# EAGLE design ASBS_radio_v1_2 (EAGLE 5.11)
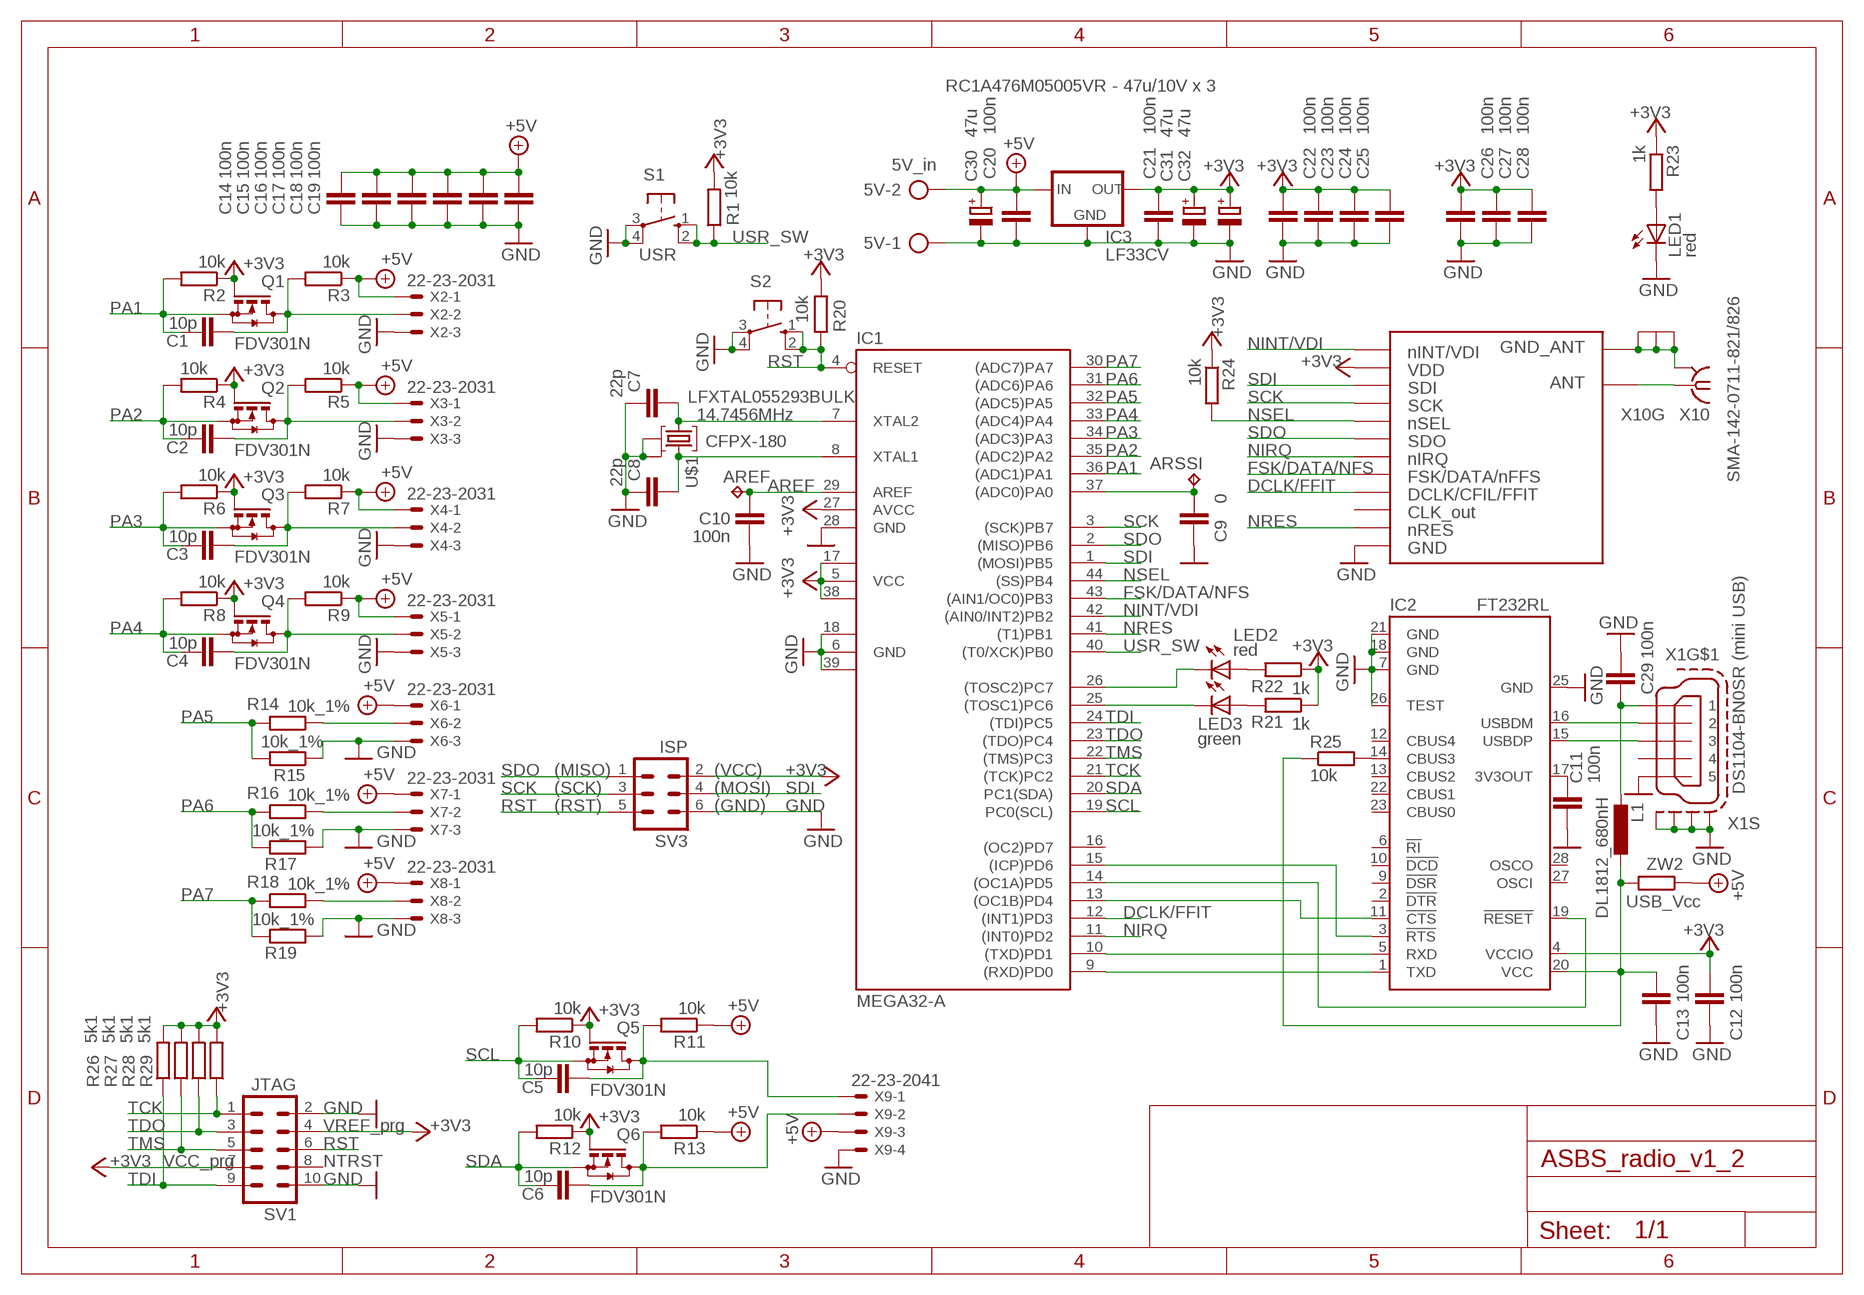
[diagram p0: schematic, sheet 1]

## Parts
5V  5V_in  AK500/2  [AK500/2]
AREF  TPPAD1-13  [P1-13]
ARSSI  TPPAD1-13  [P1-13]
C1  10p  C-EUC0603K  [C0603K]
C2  10p  C-EUC0603K  [C0603K]
C3  10p  C-EUC0603K  [C0603K]
C4  10p  C-EUC0603K  [C0603K]
C5  10p  C-EUC0603K  [C0603K]
C6  10p  C-EUC0603K  [C0603K]
C7  22p  C-EUC0603K  [C0603K]
C8  22p  C-EUC0603K  [C0603K]
C9  0  C-EUC0805  [C0805]
C10  100n  C-EUC0805  [C0805]
C11  100n  C-EUC0805  [C0805]
C12  100n  C-EUC0805  [C0805]
C13  100n  C-EUC0805  [C0805]
C14  100n  C-EUC0805  [C0805]
C15  100n  C-EUC0805  [C0805]
C16  100n  C-EUC0805  [C0805]
C17  100n  C-EUC0805  [C0805]
C18  100n  C-EUC0805  [C0805]
C19  100n  C-EUC0805  [C0805]
C20  100n  C-EUC0805  [C0805]
C21  100n  C-EUC0805  [C0805]
C22  100n  C-EUC0805  [C0805]
C23  100n  C-EUC0805  [C0805]
C24  100n  C-EUC0805  [C0805]
C25  100n  C-EUC0805  [C0805]
C26  100n  C-EUC0805  [C0805]
C27  100n  C-EUC0805  [C0805]
C28  100n  C-EUC0805  [C0805]
C29  100n  C-EUC0805  [C0805]
C30  47u  CPOL-EU153CLV-0505  [153CLV-0505]
C31  47u  CPOL-EU153CLV-0505  [153CLV-0505]
C32  47u  CPOL-EU153CLV-0505  [153CLV-0505]
IC1  MEGA32-A  [TQFP44]
IC2  FT232RL  [SSOP28]
IC3  LF33CV  78XXS  [78XXS]
L1  DL1812_680nH  L-EUL4516C  [L4516C]
LED1  red  LEDCHIP-LED0805  [CHIP-LED0805]
LED2  red  LEDCHIP-LED0805  [CHIP-LED0805]
LED3  green  LEDCHIP-LED0805  [CHIP-LED0805]
Q1  FDV301N  BSS123  [SOT23]
Q2  FDV301N  BSS123  [SOT23]
Q3  FDV301N  BSS123  [SOT23]
Q4  FDV301N  BSS123  [SOT23]
Q5  FDV301N  BSS123  [SOT23]
Q6  FDV301N  BSS123  [SOT23]
R1  10k  R-EU_R0603  [R0603]
R2  10k  R-EU_R0603  [R0603]
R3  10k  R-EU_R0603  [R0603]
R4  10k  R-EU_R0603  [R0603]
R5  10k  R-EU_R0603  [R0603]
R6  10k  R-EU_R0603  [R0603]
R7  10k  R-EU_R0603  [R0603]
R8  10k  R-EU_R0603  [R0603]
R9  10k  R-EU_R0603  [R0603]
R10  10k  R-EU_R0603  [R0603]
R11  10k  R-EU_R0603  [R0603]
R12  10k  R-EU_R0603  [R0603]
R13  10k  R-EU_R0603  [R0603]
R14  10k_1%  R-EU_R0603  [R0603]
R15  10k_1%  R-EU_R0603  [R0603]
R16  10k_1%  R-EU_R0603  [R0603]
R17  10k_1%  R-EU_R0603  [R0603]
R18  10k_1%  R-EU_R0603  [R0603]
R19  10k_1%  R-EU_R0603  [R0603]
R20  10k  R-EU_R0603  [R0603]
R21  1k  R-EU_R0603  [R0603]
R22  1k  R-EU_R0603  [R0603]
R23  1k  R-EU_R0603  [R0603]
R24  10k  R-EU_R0603  [R0603]
R25  10k  R-EU_R0603  [R0603]
R26  5k1  R-EU_R0603  [R0603]
R27  5k1  R-EU_R0603  [R0603]
R28  5k1  R-EU_R0603  [R0603]
R29  5k1  R-EU_R0603  [R0603]
S1  USR  10-XX  [B3F-10XX]
S2  RST  10-XX  [B3F-10XX]
SV1  JTAG  MA05-2  [MA05-2]
SV3  ISP  MA03-2  [MA03-2]
U$1  CFPX-180  [CFPX-180]
U$2  RFM12BS  [RFM12B_RF_SMD]
X1  DS1104-BN0SR (mini USB)  MINI-USB-SCHIELD-32005-201  [32005-201]
X2  22-23-2031  [22-23-2031]
X3  22-23-2031  [22-23-2031]
X4  22-23-2031  [22-23-2031]
X5  22-23-2031  [22-23-2031]
X6  22-23-2031  [22-23-2031]
X7  22-23-2031  [22-23-2031]
X8  22-23-2031  [22-23-2031]
X9  22-23-2041  [22-23-2041]
X10  SMA-142-0711-821/826  [J502-ND-142-0711-821/826]
ZW2  USB_Vcc  R-EU_R0603  [R0603]

## Nets
+3V3: C12.2 C21.1 C22.1 C23.1 C24.1 C25.1 C26.1 C27.1 C28.1 C31.+ C32.+ IC1.5(VCC) IC1.17(VCC1) IC1.27(AVCC) IC1.38(VCC2) IC2.4(VCCIO) IC3.OUT Q1.1(G) Q2.1(G) Q3.1(G) Q4.1(G) Q5.1(G) Q6.1(G) R1.2 R2.1 R4.1 R6.1 R8.1 R10.1 R12.1 R20.2 R21.1 R22.1 R23.1 R24.1 R26.2 R27.2 R28.2 R29.2 SV1.4 SV1.7 SV3.2 U$2.P$2
+5V: 5V.2 C14.1 C15.1 C16.1 C17.1 C18.1 C19.1 C20.1 C30.+ IC3.IN R3.1 R5.1 R7.1 R9.1 R11.1 R13.1 X2.1 X3.1 X4.1 X5.1 X6.1 X7.1 X8.1 X9.3 ZW2.1
AREF: AREF.TP C10.2 IC1.29(AREF)
ARSSI: ARSSI.TP C9.2 IC1.37((ADC0)PA0)
DCLK/FFIT: IC1.12((INT1)PD3) U$2.P$9
FSK/DATA/NFS: IC1.43((AIN1/OC0)PB3) U$2.P$8
GND: 5V.1 C7.1 C8.1 C9.1 C10.1 C11.2 C12.1 C13.1 C14.2 C15.2 C16.2 C17.2 C18.2 C19.2 C20.2 C21.2 C22.2 C23.2 C24.2 C25.2 C26.2 C27.2 C28.2 C29.1 C30.- C31.- C32.- IC1.6(GND) IC1.18(GND1) IC1.28(GND) IC1.39(GND2) IC2.7(GND) IC2.18(GND) IC2.21(GND) IC2.25(GND) IC2.26(TEST) IC3.GND LED1.C R15.1 R17.1 R19.1 S1.3(P) S1.4(P1) S2.3(P) S2.4(P1) SV1.2 SV1.10 SV3.6 U$1.P$2 U$1.P$4 U$2.P$12 X1.5 X1.M1(S:S1) X1.M2(S:S2) X1.M3(S:S3) X1.M4(S:S4) X2.3 X3.3 X4.3 X5.3 X6.3 X7.3 X8.3 X9.4
N$1: IC1.13((OC1B)PD4) IC2.11(!CTS)
N$2: IC1.14((OC1A)PD5) IC2.19(!RESET)
N$3: IC1.15((ICP)PD6) IC2.3(!RTS)
N$4: C2.2 Q2.3(D) R5.2 X3.2
N$5: C8.2 IC1.8(XTAL1) U$1.P$3
N$6: C7.2 IC1.7(XTAL2) U$1.P$1
N$7: IC2.14(CBUS3) R25.2
N$8: C3.2 Q3.3(D) R7.2 X4.2
N$9: C1.2 Q1.3(D) R3.2 X2.2
N$10: C4.2 Q4.3(D) R9.2 X5.2
N$11: U$2.P$13 X10.1
N$12: R14.1 X6.2
N$13: R16.1 X7.2
N$14: IC1.26((TOSC2)PC7) LED2.C
N$15: IC1.9((RXD)PD0) IC2.1(TXD)
N$16: IC1.10((TXD)PD1) IC2.5(RXD)
N$17: IC1.25((TOSC1)PC6) LED3.C
N$18: LED3.A R21.2
N$19: LED2.A R22.2
N$20: R18.1 X8.2
N$21: LED1.A R23.2
N$22: C5.2 Q5.3(D) R11.2 X9.1
N$23: C6.2 Q6.3(D) R13.2 X9.2
N$39: C13.2 IC2.20(VCC) L1.1 R25.1 ZW2.2
N$43: C29.2 L1.2 X1.1
N$44: IC2.16(USBDM) X1.2
N$45: IC2.15(USBDP) X1.3
N$46: C11.1 IC2.17(3V3OUT)
NINT/VDI: IC1.42((AIN0/INT2)PB2) U$2.P$1
NIRQ: IC1.11((INT0)PD2) U$2.P$7
NRES: IC1.41((T1)PB1) U$2.P$11
NSEL: IC1.44((SS)PB4) R24.2 U$2.P$5
PA1: C1.1 IC1.36((ADC1)PA1) Q1.2(S) R2.2
PA2: C2.1 IC1.35((ADC2)PA2) Q2.2(S) R4.2
PA3: C3.1 IC1.34((ADC3)PA3) Q3.2(S) R6.2
PA4: C4.1 IC1.33((ADC4)PA4) Q4.2(S) R8.2
PA5: IC1.32((ADC5)PA5) R14.2 R15.2
PA6: IC1.31((ADC6)PA6) R16.2 R17.2
PA7: IC1.30((ADC7)PA7) R18.2 R19.2
RGND: U$2.P$14 X10.G@1(GND) X10.G@2(GND) X10.G@3(GND) X10.G@4(GND)
RST: IC1.4(RESET) R20.1 S2.1(S) S2.2(S1) SV1.6 SV3.5
SCK: IC1.3((SCK)PB7) SV3.3 U$2.P$4
SCL: C5.1 IC1.19(PC0(SCL)) Q5.2(S) R10.2
SDA: C6.1 IC1.20(PC1(SDA)) Q6.2(S) R12.2
SDI: IC1.1((MOSI)PB5) SV3.4 U$2.P$3
SDO: IC1.2((MISO)PB6) SV3.1 U$2.P$6
TCK: IC1.21((TCK)PC2) R29.1 SV1.1
TDI: IC1.24((TDI)PC5) R26.1 SV1.9
TDO: IC1.23((TDO)PC4) R28.1 SV1.3
TMS: IC1.22((TMS)PC3) R27.1 SV1.5
USR_SW: IC1.40((T0/XCK)PB0) R1.1 S1.1(S) S1.2(S1)
Unconnected: IC1.16((OC2)PD7) IC2.2(!DTR) IC2.6(!RI) IC2.9(!DSR) IC2.10(!DCD) IC2.12(CBUS4) IC2.13(CBUS2) IC2.22(CBUS1) IC2.23(CBUS0) IC2.27(OSCI) IC2.28(OSCO) SV1.8 U$2.P$10 X1.4

## Notes on the sheet
- RC1A476M05005VR - 47u/10V x 3
- LFXTAL055293BULK
- 14.7456MHz
- (MISO) | (VCC)
- (SCK) | (MOSI)
- (RST) | (GND)
- GND
- VREF_prg
- VCC_prg | NTRST
- GND

## Library data of the parts
5V = con-ptr500:AK500/2: CONNECTOR; OC_FARNELL: unknown; OC_NEWARK: unknown
AREF ARSSI = testpad:TP: Test pad
C1-C6 C9-C29 = rcl:C-EU: CAPACITOR, European symbol
C7 C8 = resistor:C-EU: CAPACITOR, European symbol
C30-C32 = rcl:CPOL-EU: POLARIZED CAPACITOR, European symbol
IC1 = atmel:MEGA32: MICROCONTROLLER 32 Kbytes FLASH 2 Kbytes SRAM 1 Kbytes EEPROM USART 8-channel 10 bit ADC Source: www.atmel.com .. doc2503.pdf; MPN: ATMEGA32-16AU; OC_FARNELL: 9171274; OC_NEWARK: 69K6677
IC2 = ftdichip:FT232R: Source: http://www.ftdichip.com/Documents/DataSheets/DS_FT232R_v104.pdf; MPN: FT232RL; OC_FARNELL: 1146032; OC_NEWARK: 91K9918
IC3 = v-reg:78XXS: VOLTAGE REGULATOR
L1 = rcl:L-EU: INDUCTOR, European symbol
LED1-LED3 = led:LED: LED OSRAM: - CHIPLED LG R971, LG N971, LY N971, LG Q971, LY Q971, LO R971, LY R971 LH N974, LH R974 LS Q976, LO Q976, LY Q976 LO Q996 - Hyper CHIPLED LW Q18S LB Q993, LB Q99A, LB R99A - SideLED LS A670, LO A670, LY A670, LG A670, LP A670 LB A673, LV A673, LT A673, LW A673 LH A674 LY A675 LS A676, LA A676, LO A676, LY A676, LW A676 LS A679, LY A679, LG A679 - Hyper Micro SIDELED® LS Y876, LA Y876, LO Y876, LY Y876 LT Y87S - SmartLED LW L88C, LW L88S LB L89C, LB L89S, LG L890 LS L89K, LO L89K, LY L89K LS L896, LA L896, LO L896, LY L896 - TOPLED LS T670, LO T670, LY T670, LG T670, LP T670 LSG T670, LSP T670, LSY T670, LOP T670, LYG T670 LG T671, LOG T671, LSG T671 LB T673, LV T673, LT T673, LW T673 LH T674 LS T676, LA T676, LO T676, LY T676, LB T676, LH T676, LSB T676, LW T676 LB T67C, LV T67C, LT T67C, LS T67K, LO T67K, LY T67K, LW E67C LS E67B, LA E67B, LO E67B, LY E67B, LB E67C, LV E67C, LT E67C LW T67C LS T679, LY T679, LG T679 LS T770, LO T770, LY T770, LG T770, LP T770 LB T773, LV T773, LT T773, LW T773 LH T774 LS E675, LA E675, LY E675, LS T675 LS T776, LA T776, LO T776, LY T776, LB T776 LHGB T686 LT T68C, LB T68C - Hyper Mini TOPLED® LB M676 - Mini TOPLED Santana® LG M470 LS M47K, LO M47K, LY M47K Source: http://www.osram.convergy.de LUXEON: - LUMILED® LXK2-PW12-R00, LXK2-PW12-S00, LXK2-PW14-U00, LXK2-PW14-V00 LXK2-PM12-R00, LXK2-PM12-S00, LXK2-PM14-U00 LXK2-PE12-Q00, LXK2-PE12-R00, LXK2-PE12-S00, LXK2-PE14-T00, LXK2-PE14-U00 LXK2-PB12-K00, LXK2-PB12-L00, LXK2-PB12-M00, LXK2-PB14-N00, LXK2-PB14-P00, LXK2-PB14-Q00 LXK2-PR12-L00, LXK2-PR12-M00, LXK2-PR14-Q00, LXK2-PR14-R00 LXK2-PD12-Q00, LXK2-PD12-R00, LXK2-PD12-S00 LXK2-PH12-R00, LXK2-PH12-S00 LXK2-PL12-P00, LXK2-PL12-Q00, LXK2-PL12-R00 Source: www.luxeon.com KINGBRIGHT: KA-3528ASYC Source: www.kingbright.com
Q1-Q6 = transistor-small-signal:BSS123: N-CHANNEL MOS FET
R1-R29 ZW2 = resistor:R-EU_: RESISTOR, European symbol
S1 S2 = switch-omron:10-XX: OMRON SWITCH; MPN: B3F-1000; OC_FARNELL: 176432; OC_NEWARK: 36M3542
SV1 = con-lstb:MA05-2: PIN HEADER; OC_FARNELL: unknown; OC_NEWARK: unknown
SV3 = con-lstb:MA03-2: PIN HEADER; OC_FARNELL: unknown; OC_NEWARK: unknown
U$1 = crystal_frequency_products:CFPX-180
U$2 = RFM12B:RFM12B
X1 = con-cypressindustries:MINI-USB-SCHIELD-: MINI USB-B Conector Source: www.cypressindustries.com; OC_FARNELL: unknown; OC_NEWARK: unknown
X2-X8 = con-molex:22-23-2031: .100" (2.54mm) Center Header - 3 Pin; MF: MOLEX; MPN: 22-23-2031; OC_FARNELL: 1462950; OC_NEWARK: 30C0862
X9 = con-molex:22-23-2041: .100" (2.54mm) Center Header - 4 Pin; MF: MOLEX; MPN: 22-23-2041; OC_FARNELL: 1462920; OC_NEWARK: 38C0355
X10 = con-coax:SMA-: SMA 50 Ohm End Launch Jack Receptacle - Round Contact Johnson Components Source: www.johnsoncomponents.com .. J502-ND.pdf; MF: JOHNSON COMPONENTS; MPN: 142-0711-821; OC_FARNELL: 1019328; OC_NEWARK: 16F3627

## Board
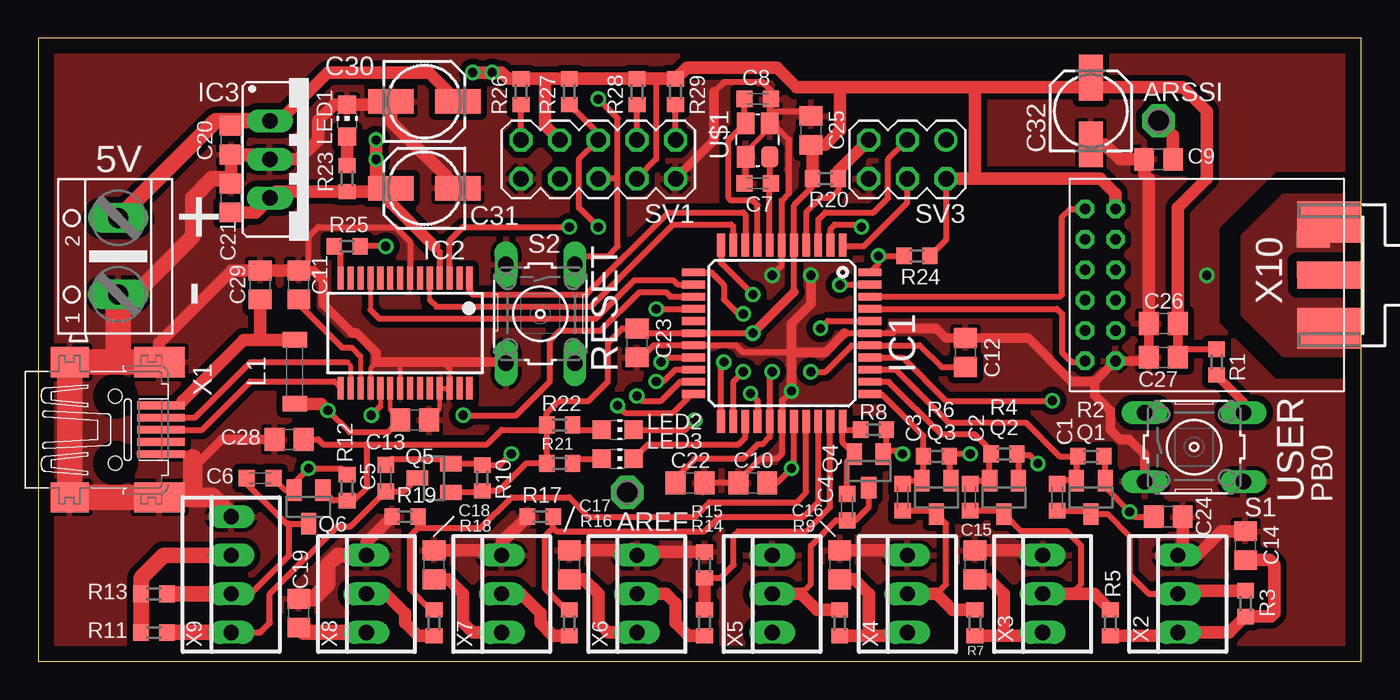
[diagram p1: board, top side]
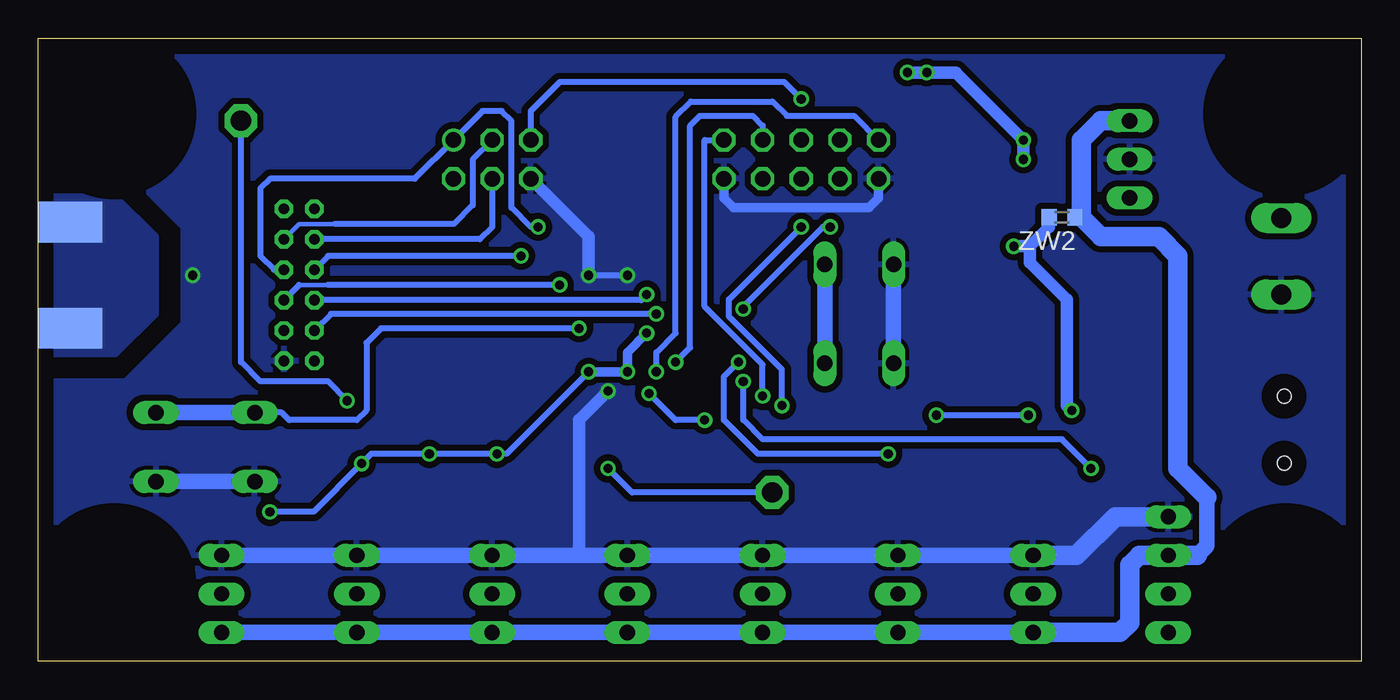
[diagram p2: board, bottom side, seen from below]

Size 87 x 41 mm. Coordinates in mm from the lower left corner, seen from the top.
Outline: 0,0 87,0 87,41 0,41 0,0
Copper layers (1*16): Top 0.035mm / dielectric 1.5mm / Bottom 0.035mm
Design rules "default *": minimum track width 10mil, minimum drill 0.4mm, track to track 9mil, track to pad 9mil, pad to pad 9mil, via to via 9mil, smd to smd 8mil, copper to edge 40mil, drill to drill 8mil, minimum pad ring 10mil, minimum via ring 8mil, stop-mask expansion 4mil, vias tented up to drill 0mil, thermal gap 10mil
bRestrict: area 77.5,0.5 to 86.5,9.5; area 77.5,31.5 to 86.5,40.5; area 0.5,0.5 to 9.5,9.5; area 0.5,31.5 to 9.5,40.5

### Footprints (pad centres in the part's own frame; a part is rotated, then mirrored left to right if it is on the bottom)
AK500/2 = drill 1.321 long: 1 -2.515,0; 2 2.515,0
P1-13 = drill 1.321 pad 2.159 octagon: TP 0,0
C0603K = smd 1.05 x 1.08: 1 -0.875,0; 2 0.875,0
C0805 = smd 1.3 x 1.5: 1 -0.95,0; 2 0.95,0
153CLV-0505 = smd 3 x 1.6: + 2.2,0; - -2.2,0
TQFP44 = smd 1.5 x 0.5: 1 -5.8,4; 2 -5.8,3.2; 3 -5.8,2.4; 4 -5.8,1.6; 5 -5.8,0.8; 6 -5.8,0; 7 -5.8,-0.8; 8 -5.8,-1.6; 9 -5.8,-2.4; 10 -5.8,-3.2; 11 -5.8,-4; 23 5.8,-4; 24 5.8,-3.2; 25 5.8,-2.4; 26 5.8,-1.6; 27 5.8,-0.8; 28 5.8,0; 29 5.8,0.8; 30 5.8,1.6; 31 5.8,2.4; 32 5.8,3.2; 33 5.8,4 | smd 0.5 x 1.5: 12 -4,-5.8; 13 -3.2,-5.8; 14 -2.4,-5.8; 15 -1.6,-5.8; 16 -0.8,-5.8; 17 0,-5.8; 18 0.8,-5.8; 19 1.6,-5.8; 20 2.4,-5.8; 21 3.2,-5.8; 22 4,-5.8; 34 4,5.8; 35 3.2,5.8; 36 2.4,5.8; 37 1.6,5.8; 38 0.8,5.8; 39 0,5.8; 40 -0.8,5.8; 41 -1.6,5.8; 42 -2.4,5.8; 43 -3.2,5.8; 44 -4,5.8
SSOP28 = smd 0.4 x 1.5: 1 -4.225,-3.625; 2 -3.575,-3.625; 3 -2.925,-3.625; 4 -2.275,-3.625; 5 -1.625,-3.625; 6 -0.975,-3.625; 7 -0.325,-3.625; 8 0.325,-3.625; 9 0.975,-3.625; 10 1.625,-3.625; 11 2.275,-3.625; 12 2.925,-3.625; 13 3.575,-3.625; 14 4.225,-3.625; 15 4.225,3.625; 16 3.575,3.625; 17 2.925,3.625; 18 2.275,3.625; 19 1.625,3.625; 20 0.975,3.625; 21 0.325,3.625; 22 -0.325,3.625; 23 -0.975,3.625; 24 -1.625,3.625; 25 -2.275,3.625; 26 -2.925,3.625; 27 -3.575,3.625; 28 -4.225,3.625
78XXS = drill 1.016 long: GND 0,-2.54; IN -2.54,-2.54; OUT 2.54,-2.54
L4516C = smd 1 x 1.6: 1 -2.1,0; 2 2.1,0
CHIP-LED0805 = smd 1.2 x 1.2: A 0,-1.05; C 0,1.05
SOT23 = smd 1 x 1.4: 1 -0.95,-1.1; 2 0.95,-1.1; 3 0,1.1
R0603 = smd 1 x 1.1: 1 -0.85,0; 2 0.85,0
B3F-10XX = drill 1.016 long: 1 -3.251,2.261; 2 3.251,2.261; 3 -3.251,-2.261; 4 3.251,-2.261
MA05-2 = drill 1.016 octagon: 1 -5.08,-1.27; 2 -5.08,1.27; 3 -2.54,-1.27; 4 -2.54,1.27; 5 0,-1.27; 6 0,1.27; 7 2.54,-1.27; 8 2.54,1.27; 9 5.08,-1.27; 10 5.08,1.27
MA03-2 = drill 1.016 round: 1 -2.54,-1.27 | drill 1.016 octagon: 2 -2.54,1.27; 3 0,-1.27; 4 0,1.27; 5 2.54,-1.27; 6 2.54,1.27
CFPX-180 = smd 1.4 x 1.15: P$1 -1.1,-0.8; P$2 1.1,-0.8; P$3 1.1,0.8; P$4 -1.1,0.8
RFM12B_RF_SMD = drill 0.7 octagon: P$1 -8,5; P$2 -6,5; P$3 -8,3; P$4 -6,3; P$5 -8,1; P$6 -6,1; P$7 -8,-1; P$8 -6,-1; P$9 -8,-3; P$10 -6,-3; P$11 -8,-5; P$12 -6,-5 | smd 2.184 x 1.067: P$13 7,1; P$14 7,3
32005-201 = smd 3.1 x 0.5: 1 3,1.6; 2 3,0.8; 3 3,0; 4 3,-0.8; 5 3,-1.6 | smd 2.5 x 2: M1 -3,-4.45; M2 -3,4.45 | smd 3.3 x 2: M3 2.9,4.45; M4 2.9,-4.45 | hole 0.9: 0,2.2; 0,-2.2
22-23-2031 = drill 1 long: 1 -2.54,0; 2 0,0; 3 2.54,0
22-23-2041 = drill 1 long: 1 -3.81,0; 2 -1.27,0; 3 1.27,0; 4 3.81,0
J502-ND-142-0711-821/826 = smd 4.191 x 1.778: 1 2.115,0 | smd 4.191 x 2.667: G@1 2.115,3.495; G@2 2.115,-3.495 | smd 4.191 x 2.667 bottom: G@3 2.115,3.495; G@4 2.115,-3.495

### Placement (x,y rotation side)
5V  5.27,26.65 90 top
AREF  38.73,11.11 0 top
ARSSI  73.66,35.56 0 top
C1  66.99,10.79 270 top
C2  61.28,10.79 270 top
C3  56.83,10.79 270 top
C4  53.18,10.16 270 top
C5  22.86,12.06 270 top
C6  14.61,12.06 180 top
C7  47.31,31.43 0 top
C8  47.31,36.99 180 top
C9  73.66,33.02 0 top
C10  46.99,11.75 0 top
C11  17.14,24.77 90 top
C12  60.96,20.32 270 top
C13  24.77,15.88 180 top
C14  79.38,7.62 90 top
C15  61.59,6.35 90 top
C16  52.7,6.35 90 top
C17  34.92,6.35 90 top
C18  26.04,6.35 90 top
C19  17.14,3.17 90 top
C20  12.7,34.29 270 top
C21  12.7,30.48 90 top
C22  42.86,11.75 0 top
C23  39.37,20.95 270 top
C24  74.3,9.53 0 top
C25  50.8,34.92 90 top
C26  73.98,22.23 180 top
C27  73.98,20 180 top
C28  16.51,14.61 180 top
C29  14.61,24.77 270 top
C30  25.4,36.83 0 top
C31  25.4,31.11 180 top
C32  69.22,36.2 90 top
IC1  48.9,21.59 270 top
IC2  24.13,21.59 180 top
IC3  17.78,33.02 270 top
L1  16.88,19.05 90 top
LED1  20.32,35.56 0 top
LED2  38.1,15.24 270 top
LED3  38.1,13.34 270 top
Q1  69.22,10.79 180 top
Q2  63.5,10.79 180 top
Q3  59.05,10.79 180 top
Q4  54.61,12.54 180 top
Q5  26.04,12.06 90 top
Q6  17.78,10.16 180 top
R1  77.47,19.68 90 top
R2  69.22,13.49 180 top
R3  79.38,3.81 90 top
R4  63.5,13.65 180 top
R5  70.48,2.54 90 top
R6  59.05,13.49 180 top
R7  61.59,2.54 90 top
R8  54.93,15.24 180 top
R9  52.7,2.54 90 top
R10  29.21,12.06 90 top
R11  7.62,1.91 0 top
R12  20.32,11.43 90 top
R13  7.62,4.45 0 top
R14  43.81,2.54 90 top
R15  43.81,6.35 270 top
R16  34.92,2.54 90 top
R17  33.02,9.53 0 top
R18  26.04,2.54 90 top
R19  24.13,9.53 0 top
R20  51.75,31.75 180 top
R21  34.29,13.02 0 top
R22  34.29,15.56 0 top
R23  20.32,31.75 90 top
R24  57.78,26.67 180 top
R25  20.32,27.3 180 top
R26  31.75,37.47 90 top
R27  34.92,37.47 90 top
R28  39.37,37.47 90 top
R29  41.91,37.47 90 top
S1  76,14.1 0 top
S2  33.02,22.86 270 top
SV1  36.83,33.02 180 top
SV3  57.15,33.02 180 top
U$1  47.31,34.29 90 top
U$2  76.83,24.77 0 top
X1  5.08,15.24 0 top
X2  74.93,4.45 90 top
X3  66.04,4.45 90 top
X4  57.15,4.45 90 top
X5  48.26,4.45 90 top
X6  39.37,4.45 90 top
X7  30.48,4.45 90 top
X8  21.59,4.45 90 top
X9  12.7,5.71 90 top
X10  87,25.4 180 top
ZW2  19.68,29.21 180 bottom

### Tracks (layer width: path | path; a pad name or v marks a point on that pad's centre or on a via)
+3V3  (via drill 0.6, 0.6 pad 0.3, 0.6 pad 0.61)
  Top 0.406: R22.1 R21.1 32.07,13.02 30.27,11.21 R10.1 29.11,11.12 Q5.1 | 50.9,33.87 C25.1 | C22.1 41.91,12.07 43.18,13.34 46.35,13.34 47.31,14.29 47.62,14.29 48.09,14.76 IC1.27 48.09,18.89 v48.26,19.05 | 50.8,31.85 R20.2 50.9,31.22 49.7,30.01 IC1.5 49.7,24.3 | v46.99,21.59 IC1.17 39.69,21.59 C23.1 38.41,21.91 37.47,20.95 37.47,18.41 36.2,17.14 34.29,17.14 33.44,16.3 R22.1 | SV1.4 40.64,33.02 40.64,38.31 | IC2.4 26.41,26.93 26.04,27.3 | R1.2 75.46,20.54 C27.1 | R2.1 70.17,13.39 Q1.1 70.17,11.43 v71.75,9.84 72.07,9.53 C24.1 | 64.45,13.55 Q2.1 | 64.45,13.55 R4.1 | Q3.1 59.91,11.99 R6.1 60.06,13.65 v61.28,13.65 | 55.78,13.86 R8.1 | 55.78,13.86 Q4.1 | 55.78,13.86 56.63,13.86 v56.83,13.65 | 64.45,13.55 65.19,13.55 v65.72,13.02 | v50.8,19.05 51.75,19.05 53.49,20.79 IC1.38 57.95,20.79 59.37,19.37 C12.2 | Q6.1 19.41,10.58 R12.1 20.74,10.58 21.59,11.43 21.59,14.29 | C28.1 18.41,14.61 18.73,14.29 21.59,14.29 | R22.1 33.12,15.24 30.48,15.24 29.53,14.29 21.59,14.29 | R24.1 59.69,27.73 SV3.2
  Top 0.61: v46.99,21.59 49.7,24.3 | C26.1 C27.1
  Top 0.813: R20.2 50.9,33.87 | C21.1 14.29,29.53 IC3.OUT 15.66,30.9 R23.1 22.23,30.9 | 33.34,38.31 R26.2 30.9,38.31 30.48,38.73 v29.84,38.73 v28.57,38.73 | 33.34,38.31 R27.2 R28.2 40.64,38.31 R29.2 42.65,39.05 48.58,39.05 49.85,37.78 52.7,37.78 | SV1.7 33.34,35.24 33.34,38.31 | 26.04,27.3 23.2,30.14 C31.+ 22.98,30.9 22.23,30.9 | C25.1 51.76,33.98 52.7,34.92 52.7,37.78 | U$2.P$2 70.83,30.77 69.85,31.75 61.59,31.75 | v22.23,34.29 v22.23,33.02 22.23,30.9 | C26.1 74.93,29.84 76.83,31.75 76.83,36.2 75.25,37.78 68.58,37.78 | 61.59,37.78 68.58,37.78 | C32.+ 69.19,38.4 68.58,37.78 | 61.59,31.75 SV3.2 | 61.59,37.78 61.59,31.75 | 52.7,37.78 61.59,37.78
  Bottom 0.406: v71.75,9.84 68.9,9.84 v65.72,13.02 65.09,13.65 v61.28,13.65 v56.83,13.65 56.2,13.65 v50.8,19.05
  Bottom 0.61: v46.99,21.59 48.26,20.32 v48.26,19.05 v50.8,19.05
  Bottom 0.813: v29.84,38.73 v28.57,38.73 26.67,38.73 v22.23,34.29 v22.23,33.02
+5V
  Top 0.813: C20.1 13.02,35.56 13.97,35.56 IC3.IN 15.88,35.56 19.05,38.73 25.7,38.73 C30.+ | X3.1 65.83,1.69 63.28,1.69 | 63.28,1.69 63.5,1.91 63.5,4.45 62.55,5.4 C15.1 | 63.28,1.69 R7.1 | R5.1 74.72,1.69 X2.1 78.32,1.91 R3.1 81.06,2.96 81.28,3.17 81.28,6.35 80.96,6.67 C14.1 | 54.61,1.69 56.94,1.69 X4.1 | 54.61,1.69 R9.1 | 54.61,1.69 54.61,4.45 53.66,5.4 C16.1 | X6.1 37.47,1.91 36.83,2.54 36.83,4.45 35.88,5.4 C17.1 | X7.1 28.57,1.91 27.94,2.54 27.94,4.45 26.98,5.4 C18.1
  Top 1.016: C19.1 17.46,1.91 X8.1 | R11.1 R13.1 6.77,5.5 8.26,6.99 X9.3 | 5V.2 11.66,35.56 13.97,35.56
  Bottom 1.016: X8.1 X7.1 X6.1 X5.1 X4.1 X3.1 X2.1 | 10.79,6.99 10.16,7.62 10.16,10.79 | 18.41,29.21 ZW2.1
  Bottom 1.27: X8.1 15.88,1.91 15.24,2.54 15.24,6.35 14.61,6.99 X9.3 | X9.3 10.79,6.99 | X9.3 13.34,6.99 | IC3.IN 17.14,35.56 18.41,34.29 18.41,29.21 17.14,27.94 13.34,27.94 12.06,26.67 12.06,12.7 10.16,10.79
AREF  (via drill 0.6)
  Top 0.406: IC1.29 49.7,12.87 v49.53,12.7 48.58,11.75 C10.2
  Bottom 0.406: AREF.TP 47.94,11.11 v49.53,12.7
ARSSI  (via drill 0.6 pad 0.61)
  Top 0.406: IC1.37 56.84,19.99 59.69,17.14 v66.67,17.14
  Top 0.813: C9.2 74.61,34.61 ARSSI.TP
  Bottom 0.406: v66.67,17.14 67.94,18.41 72.39,18.41 73.66,19.68 ARSSI.TP
DCLK/FFIT  (via drill 0.6)
  Top 0.406: v46.35,22.86 46.04,22.86 45.09,23.81 45.09,24.77 44.26,25.59 IC1.12
  Bottom 0.406: U$2.P$9 67.74,22.86 v46.35,22.86
FSK/DATA/NFS  (via drill 0.6)
  Top 0.406: v52.7,24.77 52.73,24.79 IC1.43
  Bottom 0.305: 67.94,24.77 69.85,24.77
  Bottom 0.406: U$2.P$8 69.85,24.75 69.85,24.77 | v52.7,24.77 67.94,24.77
GND  (via drill 0.6)
  Top 0.305: IC2.18 21.86,19.32 22.23,19.68 | 27.05,19.3 IC2.26 IC2.25 26.41,16.57 C13.1 | 23.8,19.68 IC2.21 | 48.11,35.09 46.51,33.49
  Top 0.406: 26.67,19.68 27.05,19.3 | v48.26,25.4 48.9,26.04 IC1.6 48.9,30.32 49.37,30.8 49.37,34.29 48.27,35.39 U$1.P$2 | U$1.P$2 48.43,35.39 | U$1.P$2 48.11,36.2 | 48.11,36.2 48.11,36.91 C8.1 48.18,37.54 47.62,38.1 45.09,38.1 44.45,37.47 | 46.51,33.49 U$1.P$4 46.51,31.51 C7.1 | U$1.P$2 48.11,35.09 | C25.2 50.48,36.2 48.11,36.2 | C22.2 C10.1 46.04,11.91 47.47,13.34 48.58,13.34 48.9,13.65 IC1.28 48.9,17.14 v49.53,17.78 | 49.53,20.32 46.35,20.32 45.88,20.79 IC1.18 40.47,20.79 39.69,20 C23.2 | 56.52,21.91 56.2,21.59 IC1.39 53.02,21.59 | 72.79,19.77 arc90 C27.2 | IC2.7 24.45,27.61 23.5,28.57 18.41,28.57 17.78,27.94 17.78,26.35 C11.2 | X1.5 9.86,13.64 10.16,13.34
  Top 0.61: C11.2 18.1,25.71 18.73,25.08 18.73,23.5 20.64,21.59 20.95,21.59 22.23,20.32 22.23,19.68 23.8,19.68 26.67,19.68 30.68,19.68 S2.4 | SV1.2 44.45,34.29 44.45,37.47 | C27.2 C26.2 | v49.53,17.78 49.53,20.32 | 53.02,21.59 51.75,20.32 49.53,20.32 | v50.8,25.4 50.8,23.5 49.53,22.23 49.53,20.32 | S1.3 72.74,13.62 71.75,14.61 71.12,14.61 70.48,15.24 70.48,16.51 69.48,17.51 69.48,18.41 | 56.52,21.91 59.05,21.91 59.69,21.27 C12.1 65.09,21.27 67.94,18.41 69.48,18.41 | 72.79,19.77 U$2.P$12 69.48,18.41 | C28.2 12.06,14.61 10.16,12.7
  Top 0.813: C11.2 C29.1 12.73,25.71 7.98,20.96 X1.M3 | C21.2 C20.2 14.92,33.34 IC3.GND 17.14,33.02 18.41,34.29 18.41,35.56 19.46,36.61 LED1.C 22.98,36.61 C30.- 23.2,35.52 C31.- | X3.3 65.72,7.3 C15.2 | C14.2 77.78,8.57 76.2,6.99 X2.3 75.25,7.3 C24.2 | R15.1 39.59,7.2 X6.3 | R17.1 30.48,7.83 X7.3 | R19.1 21.59,7.83 X8.3 | C32.- 70.14,33.99 71.12,33.02 C9.1 72.71,32.06 73.03,31.75 C26.2 | 30.16,7.3 C18.2 | 39.05,7.3 C17.2 | C16.2 56.84,7.3 X4.3
  Top 1.016: X6.3 39.05,7.3 | X7.3 30.16,7.3 | C19.2 18.09,4.12 19.05,5.08 19.05,6.35 19.68,6.99 X8.3 | 5V.1 6.36,24.14 10.16,27.94 10.16,30.48 11.43,31.75 12.38,31.75 C21.2 | X1.M4 10.16,10.79
  Top 1.27: 10.16,13.34 10.16,12.7 10.16,10.79 | X9.4 11.44,10.79 X1.M4
  Top 1.676: X1.M4 X1.M1 X1.M2 5.08,19.69 | 5.08,19.69 X1.M3 | 5V.1 5.27,19.88 5.08,19.69
  Bottom 0.406: v50.8,25.4 v48.26,25.4
  Bottom 0.61: SV1.10 31.75,30.48 32.38,29.84 41.27,29.84 41.91,30.48 SV1.2
  Bottom 0.813: v49.53,17.78 51.44,15.88 51.44,6.99 | SV3.6 50.8,27.94 v50.8,25.4
  Bottom 1.016: X8.3 X7.3 X6.3 X5.3 51.44,6.99 X4.3 X3.3 X2.3 | S2.4 S2.3 | S1.3 S1.4
  Bottom 1.27: X8.3 18.73,6.99 16.2,9.53 X9.4
  other vias: 76.83,25.4
  pour Bottom (isolate 0.406): 0,41 87,41 87,33 87,33 87,32.38 81.28,32.38 77.47,28.57 77.47,22.23 81.28,18.41 86.04,18.41 87,18.41 87,14 87,0 0,0
  pour Top (isolate 0.406): 0,41 87,41 87,34 87,32.38 83.82,32.38 81.28,32.38 77.47,28.57 77.47,22.23 81.28,18.41 86.36,18.41 87,18.41 87,0 0,0
N$1
  Top 0.305: 21.86,23.12 IC2.11
  Top 0.406: IC1.13 42.04,24.79 41.75,25.08 39.21,25.08 36.67,22.54 22.44,22.54 21.86,23.12
N$2  (via drill 0.6)
  Top 0.305: 22.5,16.79 IC2.19
  Top 0.406: v21.91,16.19 22.5,16.79 | v27.94,16.19 31.43,16.19 33.66,18.41 33.66,21.11 34.29,21.75 36.99,21.75 39.53,24.29 41.27,24.29 41.57,23.99 IC1.14
  Bottom 0.406: v21.91,16.19 v27.94,16.19
N$3  (via drill 0.6, 0.6 pad 0.61)
  Top 0.406: IC2.3 27.05,27.69 27.94,28.57 v34.92,28.57 | IC1.15 40.63,23.19 v40.64,23.18
  Bottom 0.406: v34.92,28.57 35.4,28.57 40.64,23.34 v40.64,23.18
N$4
  Top 0.406: X3.2 67.94,4.45 68.58,5.08 68.58,7.62 67.63,8.57 64.62,8.57 Q2.3 63.27,9.92 C2.2
  Top 0.813: R5.2 69.43,4.45 X3.2
N$5
  Top 0.406: IC1.8 47.31,27.4 47.31,30 46.99,30.32 45.56,30.32 45.4,30.48 45.4,34.28 U$1.P$3 46.43,35.47 C8.2
N$6
  Top 0.406: U$1.P$1 48.11,31.51 C7.2 48.09,31.34 IC1.7
N$7
  Top 0.406: IC2.14 19.91,26.87 R25.2
N$8
  Top 0.406: C3.2 58.83,9.92 Q3.3 59.69,9.06 59.69,5.08 59.05,4.45
  Top 0.813: R7.2 60.11,3.39 59.05,4.45 X4.2
N$9
  Top 0.406: C1.2 68.99,9.92 Q1.3 70.31,9.7 71.75,8.26 71.75,5.71 73.03,4.45 X2.2
  Top 0.813: X2.2 75.14,4.66 R3.2
N$10
  Top 0.406: Q4.3 54.61,10.16 53.73,9.29 C4.2 52.47,9.29 50.8,7.62 50.8,5.08 50.16,4.45
  Top 0.813: R9.2 51.22,3.39 50.16,4.45 X5.2
N$11
  Top 0.61: X10.1 84.52,25.77 U$2.P$13
N$12
  Top 0.813: R14.1 42.76,1.69 41.91,2.54 41.91,3.81 41.27,4.45 X6.2
N$13
  Top 0.813: R16.1 33.87,1.69 33.02,2.54 33.02,3.17 31.75,4.45 X7.2
N$14  (via drill 0.6)
  Top 0.406: v46.83,17.62 47.3,17.16 IC1.26 | LED2.C 42.55,15.24 v43.18,15.88
  Bottom 0.406: v43.18,15.88 45.09,15.88 v46.83,17.62
N$15
  Top 0.305: IC2.1 28.36,24.35
  Top 0.406: IC1.9 46.49,29.39 46.35,29.53 41.43,29.53 36.04,24.13 28.57,24.13 28.36,24.35
N$16
  Top 0.305: IC2.5 25.75,23.77
  Top 0.406: IC1.10 45.7,28.6 45.56,28.73 41.75,28.73 36.35,23.34 26.19,23.34 25.75,23.77
N$17
  Top 0.406: IC1.25 46.49,14.74 46.04,14.29 40.1,14.29 LED3.C
N$18
  Top 0.406: LED3.A 35.46,13.34 R21.2
N$19
  Top 0.406: LED2.A 35.46,15.24 R22.2
N$20
  Top 0.813: R18.1 24.98,1.69 24.13,2.54 24.13,3.17 22.86,4.45 X8.2
N$21
  Top 0.813: R23.2 LED1.A
N$22
  Top 0.406: X9.1 14.61,1.91 15.24,2.54 15.24,4.45 19.68,8.89 20.56,8.89 C5.2 24.06,11.19 Q5.3
  Top 1.016: R11.2 X9.1
N$23
  Top 0.406: C6.2 13.73,11.67 16.34,9.06 16.51,9.06 | 16.51,9.06 Q6.3 | X9.2 13.97,4.45 16.51,6.99 16.51,9.06
  Top 1.016: R13.2 X9.2
N$39  (via drill 0.6)
  Top 0.305: IC2.20 23.16,16.54 C13.2
  Top 0.406: v19.05,16.51 20.48,15.08 23.02,15.08 C13.2 | v22.86,27.3 R25.1
  Top 0.61: L1.1 16.88,16.88
  Top 0.813: L1.1 18.61,16.95 v19.05,16.51
  Bottom 0.813: v19.05,16.51 19.37,16.83 19.37,23.81 21.8,26.25 21.8,27.3 | 21.8,27.3 v22.86,27.3 | 21.8,27.3 20.54,28.57 ZW2.2
N$43
  Top 0.406: 9.53,17.14 9.22,16.84 X1.1
  Top 0.813: 14.61,21.15 13.53,21.15 9.53,17.14 | 14.61,21.15 C29.2 | 14.61,21.15 L1.2
N$44
  Top 0.305: 20.32,19.68 20.55,19.45 IC2.16
  Top 0.406: X1.2 10.32,16.04 13.97,19.68 20.32,19.68
N$45
  Top 0.305: 19.45,18.41 IC2.15
  Top 0.406: X1.3 10.79,15.24 13.97,18.41 19.45,18.41
N$46
  Top 0.305: 21.2,20.07 IC2.17
  Top 0.406: 21.2,20.07 20.64,20.64 20,20.64 17.14,23.5 C11.1
NINT/VDI
  Top 0.406: U$2.P$1 67.86,29.77 67.31,29.21 67.31,24.13 67.17,23.99 IC1.42
NIRQ  (via drill 0.6)
  Top 0.406: v46.99,24.13 44.9,26.23 IC1.11
  Bottom 0.406: U$2.P$7 47.35,23.77 v46.99,24.13
NRES
  Top 0.406: U$2.P$11 68.75,19.68 67.94,19.68 67.31,20.32 67.31,22.86 66.98,23.19 IC1.41
NSEL  (via drill 0.6)
  Top 0.406: IC1.44 55.24,26.14 v55.24,26.67 R24.2
  Bottom 0.406: U$2.P$5 67.93,26.67 v55.24,26.67
PA1
  Top 0.406: IC1.36 56.38,19.19 59.85,15.72 64.93,15.72 67.15,13.49 R2.2 68.27,13.39 Q1.2 67.22,11.89 C1.1
PA2
  Top 0.406: IC1.35 55.91,18.39 59.37,14.92 61.59,14.92 62.65,13.87 R4.2 62.55,13.55 Q2.2 61.5,11.89 C2.1
PA3
  Top 0.406: IC1.34 55.44,17.59 58.2,14.82 R6.2 58.2,11.99 Q3.2 57.06,11.89 C3.1
PA4
  Top 0.406: 52.9,15.24 52.9,14.41 Q4.2 53.18,13.16 C4.1 | 52.9,15.24 IC1.33 | R8.2 | 52.9,15.24 R8.2
PA5
  Top 0.406: IC1.32 52.07,15.77 52.07,10.16 50.48,8.57 46.04,8.57 45.72,8.26 45.72,6.35 44.87,5.5 R15.2
  Top 0.813: R14.2 R15.2
PA6
  Top 0.406: IC1.31 51.3,10.5 50.32,9.53 44.77,9.53 43.81,8.57 34.09,8.57 33.87,8.79 | R16.2 34.71,3.39 33.34,4.76 33.34,8.26 33.87,8.79 | 33.87,8.79 R17.2
PA7
  Top 0.406: IC1.30 50.49,11.12 49.85,10.48 44.13,10.48 43.18,9.53 36.2,9.53 34.92,10.79 31.11,10.79 29.11,8.79 24.98,8.79 | R18.2 25.82,3.39 24.45,4.76 24.45,8.26 24.98,8.79 | 24.98,8.79 R19.2
RGND  (1 unrouted)
  pour Top (isolate 0.61, no thermals): 86.36,20.32 81.92,20.32 79.38,22.86 79.38,27.94 81.92,30.48 86.36,30.48
  pour Bottom (isolate 0.61, no thermals): 86.36,20.32 81.92,20.32 79.38,22.86 79.38,27.94 81.92,30.48 86.36,30.48
RST  (via drill 0.6)
  Top 0.406: 38.1,31.75 38.1,35.72 v36.83,36.99 | IC1.4 50.49,29.54 51.44,30.48 52.07,30.48 52.6,31.01 R20.1 | S2.1 35.84,26.67 37.47,26.67 38.1,27.3 38.1,31.75 | 38.1,31.75 SV1.6
  Top 0.813: SV3.5 52.6,32.28 R20.1
  Bottom 0.406: v36.83,36.99 37.94,38.1 52.7,38.1 54.61,36.2 SV3.5
  Bottom 1.016: S2.2 S2.1
SCK
  Top 0.406: IC1.3 51.3,29.07 51.75,29.53 54.93,29.53 55.88,30.48 55.88,33.02 SV3.3
  Bottom 0.305: U$2.P$4 69.83,28.77 67.5,28.77
  Bottom 0.406: SV3.3 58.42,33.02 58.42,30 59.66,28.77 67.5,28.77
SCL  (via drill 0.6, 0.6 pad 0.41)
  Top 0.406: IC1.19 43.08,20 41.27,20 v40.96,19.68 | v31.11,13.65 30.38,12.91 R10.2 29.11,13.02 Q5.2 26.82,13.34 23.25,13.34 C5.1
  Bottom 0.406: v40.96,19.68 41.91,18.73 41.91,15.88 39.69,13.65 v31.11,13.65
SDA  (via drill 0.6, 0.6 pad 0.41)
  Top 0.406: IC1.20 41.89,19.19 41.12,18.41 v40.64,18.41 | C6.1 16.29,11.26 Q6.2 16.83,11.75 v17.78,12.7 19.9,12.7 R12.2
  Bottom 0.406: v40.64,18.41 40.64,15.88 39.37,14.61 19.68,14.61 v17.78,12.7
SDI
  Top 0.406: IC1.1 52.98,27.3 54.29,27.3 57.15,30.16 SV3.4
  Bottom 0.406: SV3.4 57.15,28.57 57.96,27.77 U$2.P$3
SDO  (via drill 0.6)
  Top 0.406: IC1.2 52.09,28.44 52.39,28.73 53.98,28.73 v54.13,28.57
  Bottom 0.406: v54.13,28.57 54.61,28.57 55.88,29.84 55.88,35.56 56.52,36.2 57.78,36.2 SV3.1 62.23,31.75 71.75,31.75 72.39,31.11 72.39,26.67 71.48,25.77 U$2.P$6
TCK  (via drill 0.6)
  Top 0.406: SV1.1 R29.1 | IC1.21 42.2,18.39 40.96,17.14 39.69,17.14 v39.37,17.46
  Bottom 0.406: SV1.1 43.18,34.29 43.18,23.34 39.37,19.53 v39.37,17.46
TDI  (via drill 0.6)
  Top 0.406: SV1.9 R26.1 | IC1.24 45.72,15.81 45.72,18.41 v46.35,19.05
  Bottom 0.406: SV1.9 33.34,35.88 37.78,35.88 38.73,36.83 44.08,36.83 45.09,35.82 45.09,21.59 46.35,20.32 v46.35,19.05
TDO  (via drill 0.6)
  Top 0.406: SV1.3 R28.1 | IC1.23 44.9,19.5 v45.09,19.68
  Bottom 0.406: v45.09,19.68 44.13,20.64 44.13,35.24 43.5,35.88 40.01,35.88 39.37,35.24 SV1.3
TMS  (via drill 0.6)
  Top 0.406: v36.83,28.57 35.56,29.84 35.56,33.02 SV1.5 36.83,34.71 R27.1 | IC1.22 42.99,17.59 41.75,16.35 38.58,16.35 v38.1,16.83
  Bottom 0.406: v38.1,16.83 38.1,19.21 41.59,22.7 41.59,23.81 v36.83,28.57
USR_SW  (via drill 0.6)
  Top 0.406: IC1.40 51.92,22.39 v51.44,21.91
  Top 0.61: R1.1 79.25,17.06 S1.2
  Bottom 0.406: v51.44,21.91 64.45,21.91 65.41,20.95 65.41,16.51 66.04,15.88 70.48,15.88 70.97,16.36 S1.1
  Bottom 1.016: S1.1 S1.2

### Text on the board
tNames: + | - | RESET | USER | PB0